# EAGLE schematic Schematic_v1_0 (EAGLE 9.6.2)
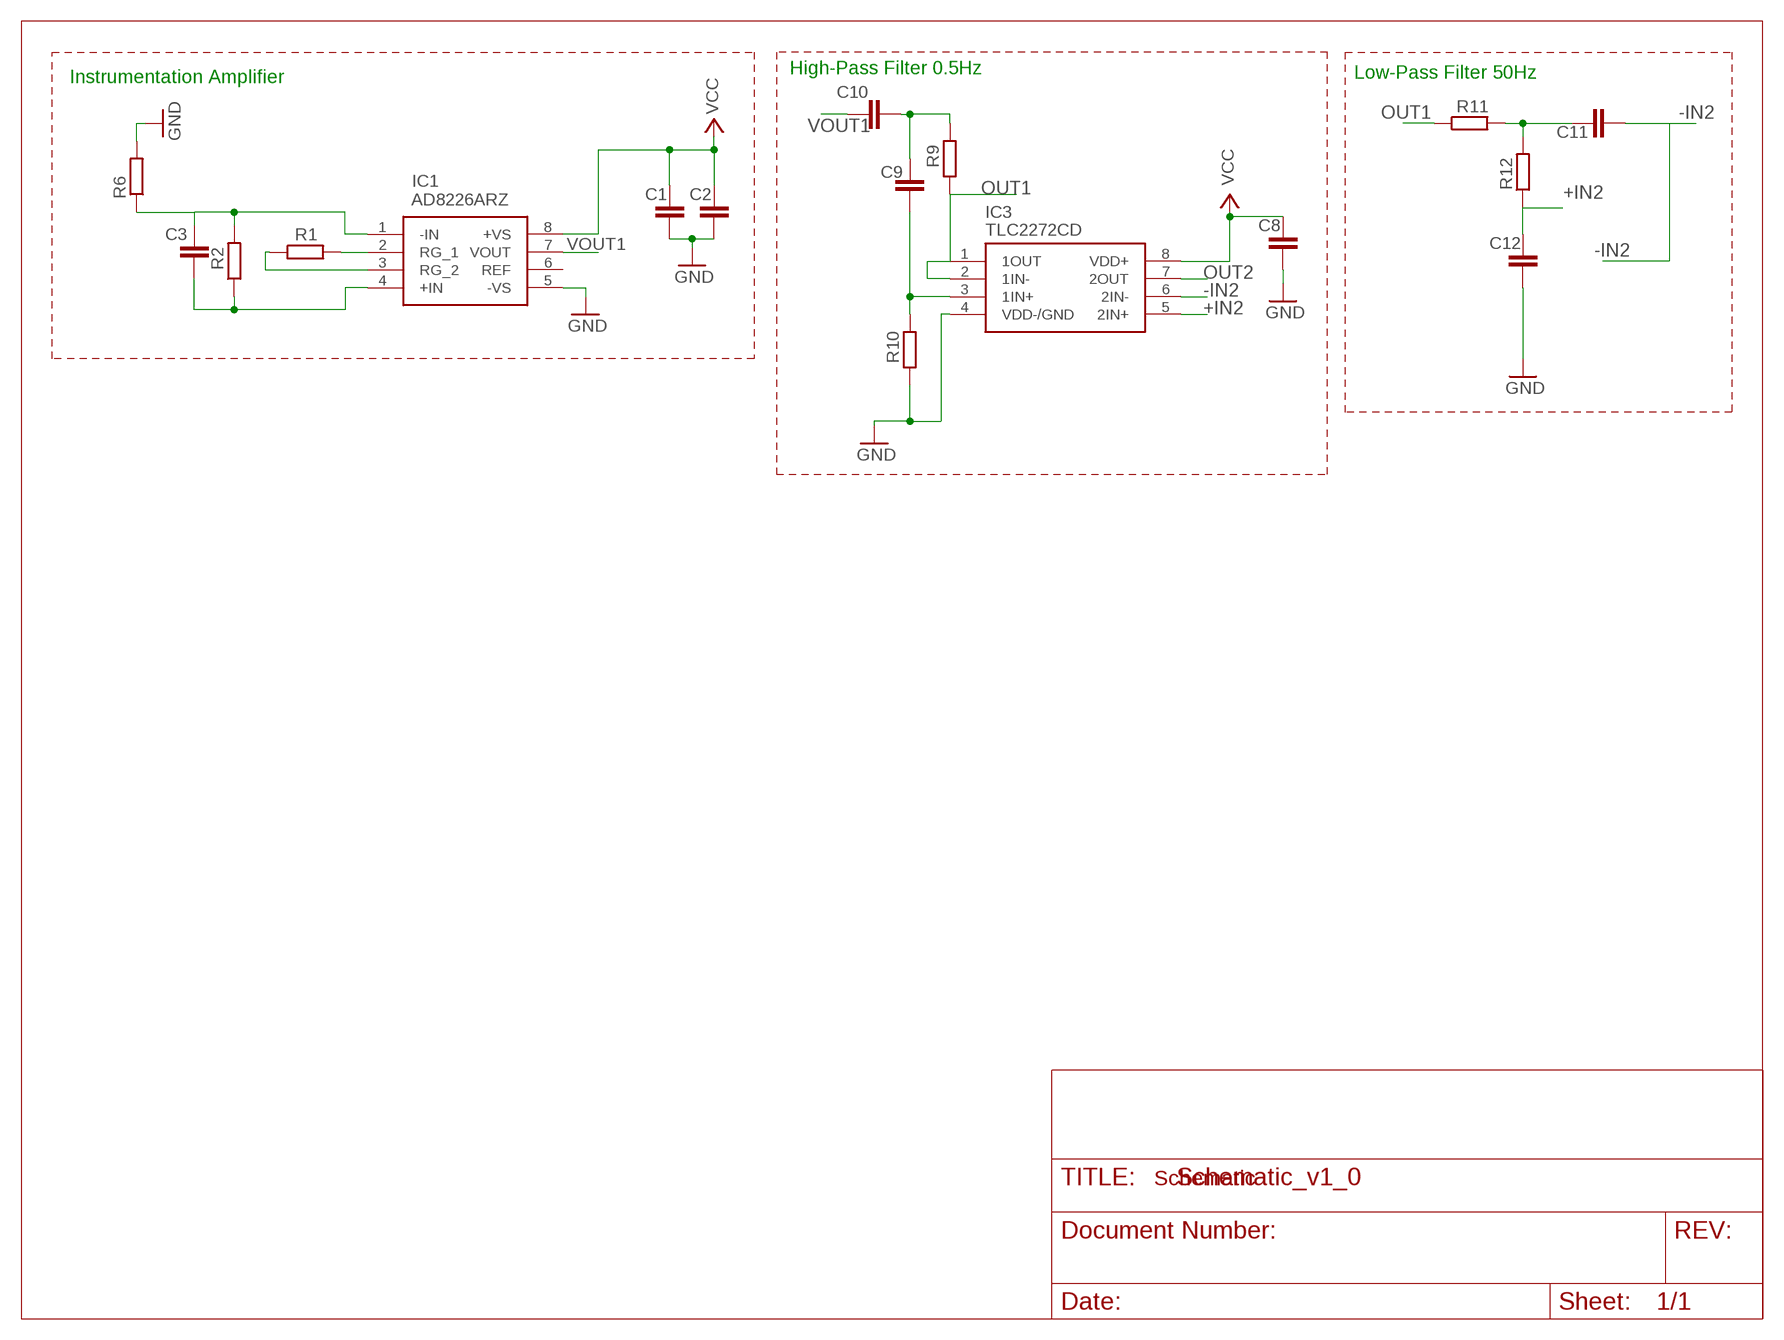
[diagram p0: schematic, sheet 1]

## Parts
C1  C-EUC0805  [C0805]
C2  C-EUC0805  [C0805]
C3  C-EUC0805  [C0805]
C8  C-EUC0805  [C0805]
C9  C-EUC0805  [C0805]
C10  C-EUC0805  [C0805]
C11  C-EUC0805  [C0805]
C12  C-EUC0805  [C0805]
IC1  AD8226ARZ  [SOIC127P600X175-8N]
IC3  TLC2272CD  [SOIC127P600X175-8N]
R1  R-EU_R0805  [R0805]
R2  R-EU_R0805  [R0805]
R6  R-EU_R0805  [R0805]
R9  R-EU_R0805  [R0805]
R10  R-EU_R0805  [R0805]
R11  R-EU_R0805  [R0805]
R12  R-EU_R0805  [R0805]

## Nets
+IN2: C12.1 IC3.5(2IN+) R12.1
-IN2: C11.2 IC3.6(2IN-)
GND: C1.2 C2.2 C8.2 C12.2 IC1.5(-VS) R6.2
N$1: IC1.2(RG_1) R1.2
N$2: IC1.3(RG_2) R1.1
N$3: C3.1 IC1.1(-IN) R2.2 R6.1
N$4: C3.2 IC1.4(+IN) R2.1
N$5: C11.1 R11.2 R12.2
N$9: IC3.4(VDD-/GND) R10.1 ; supply symbol labelled GND
N$12: C9.2 IC3.3(1IN+) R10.2
OUT1: IC3.1(1OUT) IC3.2(1IN-) R9.1 R11.1
OUT2: C9.1 C10.2 IC3.7(2OUT) R9.2
VCC: C1.1 C2.1 C8.1 IC1.8(+VS) IC3.8(VDD+)
VOUT1: C10.1 IC1.7(VOUT)
Unconnected: IC1.6(REF)

## Notes on the sheet
- High-Pass Filter 0.5Hz | Low-Pass Filter 50Hz
- Instrumentation Amplifier
- Schematic

## Library data of the parts
C1-C3 C8-C12 = rcl:C-EU: CAPACITOR, European symbol; SPICEPREFIX: C
IC1 = AD8226ARZ:AD8226ARZ: Wide Supply Range, Rail-to-Rail Output Instrumentation Amplifier Source: Datasheet <http://componentsearchengine.com/Datasheets/3/AD8226ARZ.pdf>; DESCRIPTION: Wide Supply Range, Rail-to-Rail Output Instrumentation Amplifier; HEIGHT: 1.75mm; MANUFACTURER_NAME: Analog Devices; MANUFACTURER_PART_NUMBER: AD8226ARZ; MOUSER_PART_NUMBER: 584-AD8226ARZ; MOUSER_PRICE-STOCK: https://www.mouser.co.uk/ProductDetail/Analog-Devices/AD8226ARZ?qs=%2FtpEQrCGXCzihJADRPlhCg%3D%3D
IC3 = TLC2272CD:TLC2272CD: Dual, Low-Noise, Rail-To-Rail Operational Amplifier Source: Datasheet <http://www.ti.com/lit/ds/symlink/tlc2272.pdf>; DESCRIPTION: Dual, Low-Noise, Rail-To-Rail Operational Amplifier; HEIGHT: 1.75mm; MANUFACTURER_NAME: Texas Instruments; MANUFACTURER_PART_NUMBER: TLC2272CD; MOUSER_PART_NUMBER: 595-TLC2272CD; MOUSER_PRICE-STOCK: https://www.mouser.co.uk/ProductDetail/Texas-Instruments/TLC2272CD?qs=JHHQeKcAU3DCCrMZYsil2w%3D%3D
R1 R2 R6 R9-R12 = rcl:R-EU_: RESISTOR, European symbol; SPICEPREFIX: R